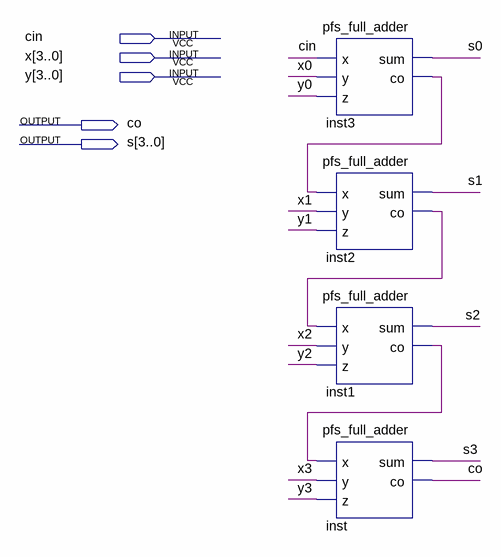
[diagram p0: schematic sheet]
// Quartus schematic pfs_rca.bdf as structural Verilog: 4 symbols, 5 pins
module pfs_rca (
  input  cin,
  input  [3:0] x,
  input  [3:0] y,
  output co,
  output [3:0] s
);

  wire inst1_co, inst2_co, inst3_co;

  pfs_full_adder inst3 (.x(cin), .y(x[0]), .z(y[0]), .sum(s[0]), .co(inst3_co));
  pfs_full_adder inst2 (.x(inst3_co), .y(x[1]), .z(y[1]), .sum(s[1]), .co(inst2_co));
  pfs_full_adder inst1 (.x(inst2_co), .y(x[2]), .z(y[2]), .sum(s[2]), .co(inst1_co));
  pfs_full_adder inst (.x(inst1_co), .y(x[3]), .z(y[3]), .sum(s[3]), .co(co));
endmodule
